# EAGLE design MQTTUSBSwitch (EAGLE 9.6.0)
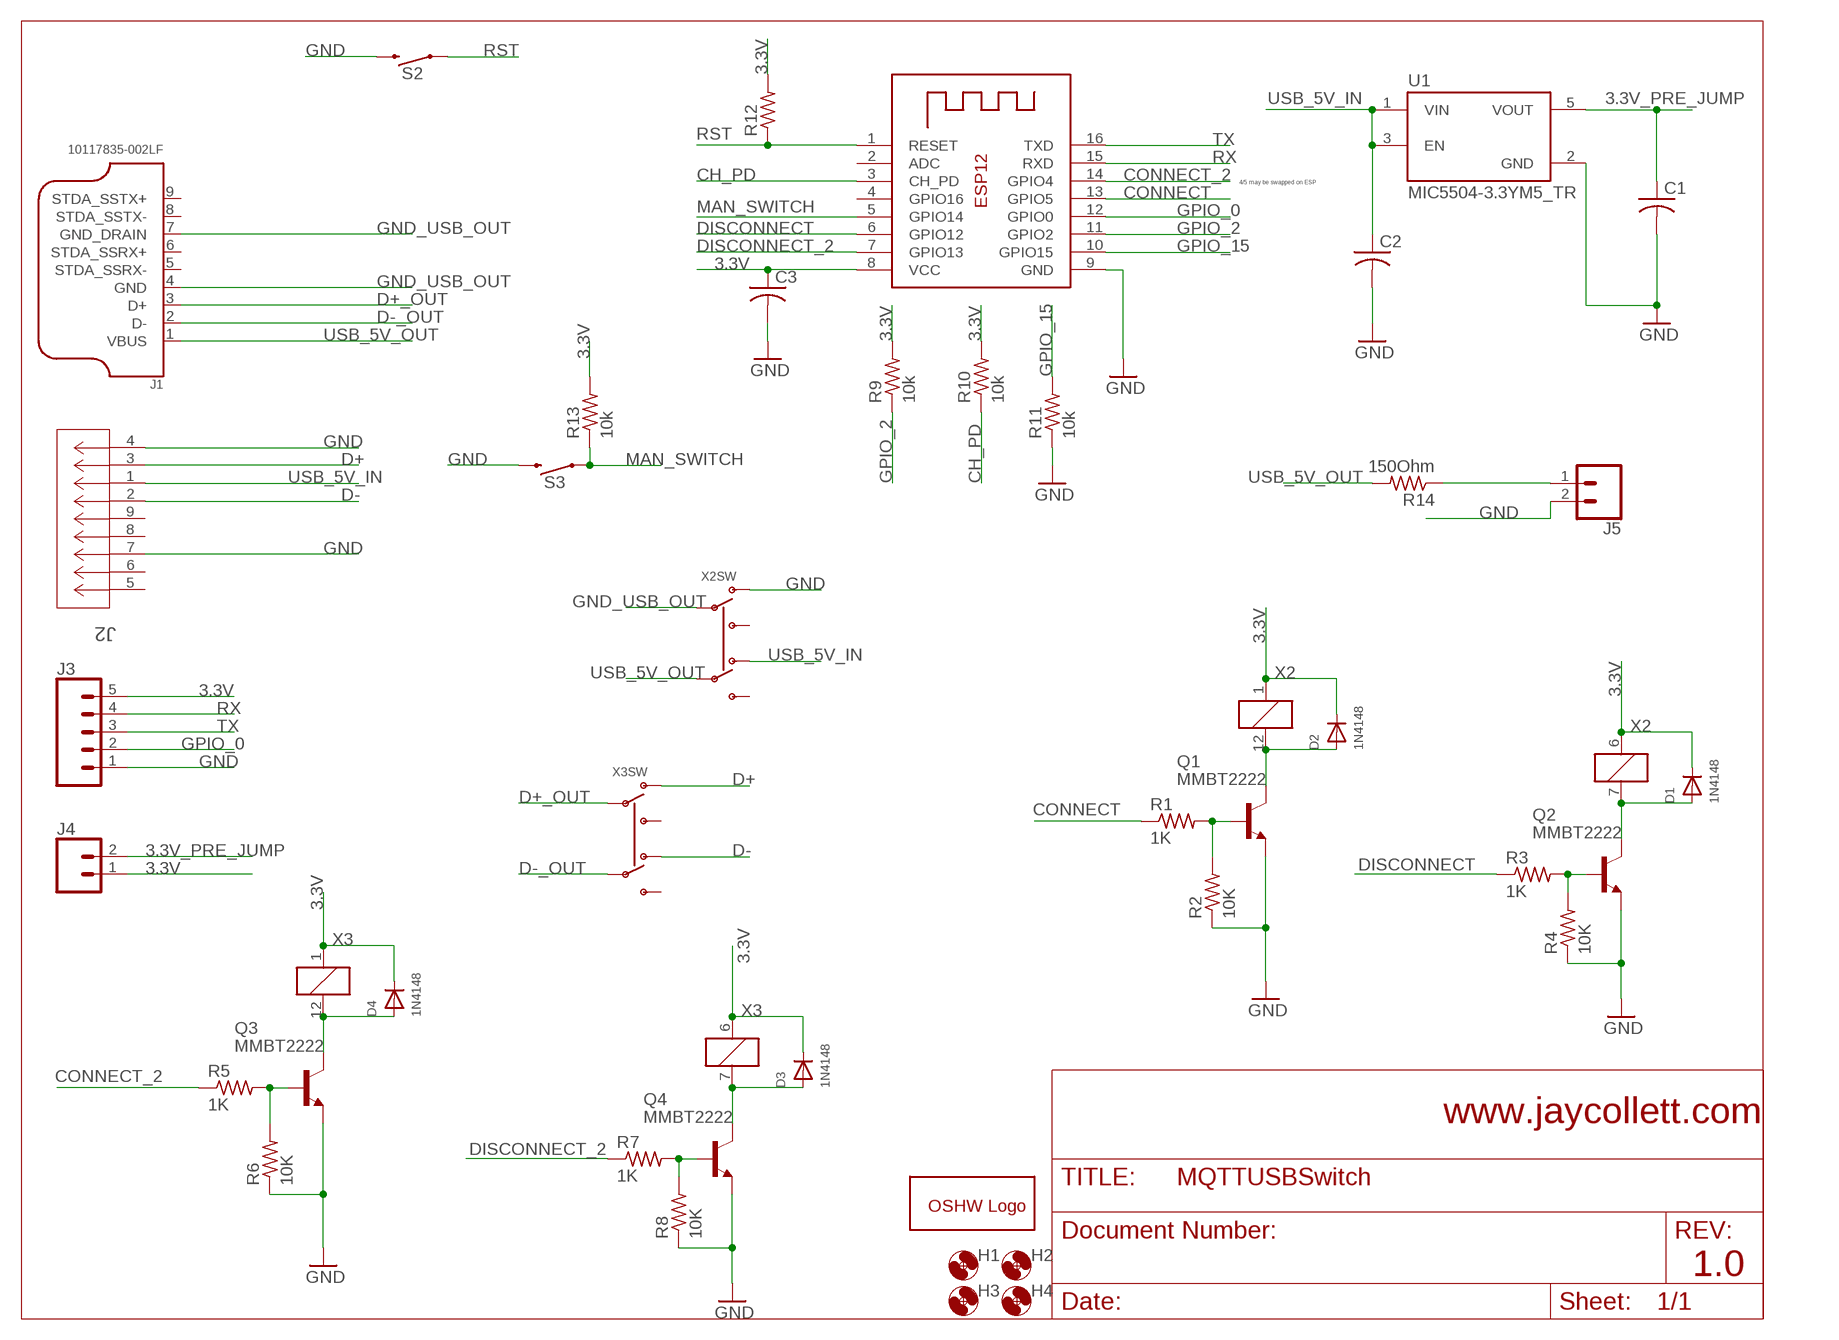
[diagram p0: schematic, sheet 1]

## Parts
C1  C-USC0805  [C0805]
C2  C-USC0805  [C0805]
C3  C-USC0805  [C0805]
D1  1N4148  DIODESOD-323F  [SOD-323F]
D2  1N4148  DIODESOD-323F  [SOD-323F]
D3  1N4148  DIODESOD-323F  [SOD-323F]
D4  1N4148  DIODESOD-323F  [SOD-323F]
GOLD_ORB_SM1  OSHWLOGOLOGO5MM  [OSHW_5MM]
H1  MOUNT-HOLE3.0  [3,0]
H2  MOUNT-HOLE3.0  [3,0]
H3  MOUNT-HOLE3.0  [3,0]
H4  MOUNT-HOLE3.0  [3,0]
J1  10117835-002LF  [FCI_10117835-002LF]
J2  GSB4211311WEU  [CONN9_1311WEU_AMP]
J3  CONN_05  [1X05]
J4  CONN_02  [1X02]
J5  CONN_02  [1X02]
Q1  MMBT2222  [SOT23-BEC]
Q2  MMBT2222  [SOT23-BEC]
Q3  MMBT2222  [SOT23-BEC]
Q4  MMBT2222  [SOT23-BEC]
R1  1K  R-US_M0805  [M0805]
R2  10K  R-US_M0805  [M0805]
R3  1K  R-US_M0805  [M0805]
R4  10K  R-US_M0805  [M0805]
R5  1K  R-US_M0805  [M0805]
R6  10K  R-US_M0805  [M0805]
R7  1K  R-US_M0805  [M0805]
R8  10K  R-US_M0805  [M0805]
R9  10k  R-US_R0805  [R0805]
R10  10k  R-US_R0805  [R0805]
R11  10k  R-US_R0805  [R0805]
R12  R-US_R0805  [R0805]
R13  10k  R-US_R0805  [R0805]
R14  150Ohm  R-US_R0805  [R0805]
S2  MOMENTARY-SWITCH-SPST-PTH-6.0MM-KIT  [TACTILE_SWITCH_PTH_6.0MM_KIT]
S3  MOMENTARY-SWITCH-SPST-PTH-6.0MM-KIT  [TACTILE_SWITCH_PTH_6.0MM_KIT]
U1  MIC5504-3.3YM5_TR  [SOT95P280X145-5N]
X1  ESP-12  [ESP-12]
X2  MICROBUILDER_RELAY_LATCHINGEE2NUH  [MICROBUILDER_RELAY_EE2_LATCH]
X3  MICROBUILDER_RELAY_LATCHINGEE2NUH  [MICROBUILDER_RELAY_EE2_LATCH]

## Nets
3.3V [3.3Volt]: C3.1 D1.C D2.C D3.C D4.C J3.5 J4.1 R9.2 R10.2 R12.2 R13.2 X1.8(VCC) X2.1 X2.6 X3.1 X3.6
3.3V_PRE_JUMP [3.3Volt]: C1.1 J4.2 U1.5(VOUT)
CH_PD: R10.1 X1.3(CH_PD)
CONNECT: R1.1 X1.13(GPIO5)
CONNECT_2: R5.1 X1.14(GPIO4)
D+: J2.3 X3.10(SW:O1)
D+_OUT: J1.3(D+) X3.9(SW:P1)
D-: J2.2 X3.3(SW:O2)
D-_OUT: J1.2(D-) X3.4(SW:P2)
DISCONNECT: R3.1 X1.6(GPIO12)
DISCONNECT_2: R7.1 X1.7(GPIO13)
GND: C1.2 C2.2 C3.2 J2.4 J2.7 J3.1 J5.2 Q1.E Q2.E Q3.E Q4.E R2.1 R4.1 R6.1 R8.1 R11.1 S2.3 S3.3 U1.2(GND) X1.9(GND) X2.10(SW:O1)
GND_USB_OUT [5.0Volt]: J1.4(GND) J1.7(GND_DRAIN) X2.9(SW:P1)
GPIO_0: J3.2 X1.12(GPIO0)
GPIO_2: R9.1 X1.11(GPIO2)
GPIO_15: R11.2 X1.10(GPIO15)
MAN_SWITCH: R13.1 S3.1 X1.5(GPIO14)
N$1: J5.1 R14.1
N$10: D2.A Q1.C X2.12
N$11: D1.A Q2.C X2.7
N$12: Q1.B R1.2 R2.2
N$13: Q2.B R3.2 R4.2
N$14: D4.A Q3.C X3.12
N$15: D3.A Q4.C X3.7
N$16: Q3.B R5.2 R6.2
N$17: Q4.B R7.2 R8.2
RST: R12.1 S2.1 X1.1(RESET)
RX: J3.4 X1.15(RXD)
TX: J3.3 X1.16(TXD)
USB_5V_IN [5.0Volt]: C2.1 J2.1 U1.1(VIN) U1.3(EN) X2.3(SW:O2)
USB_5V_OUT [5.0Volt]: J1.1(VBUS) R14.2 X2.4(SW:P2)
Unconnected: J1.5(STDA_SSRX-) J1.6(STDA_SSRX+) J1.8(STDA_SSTX-) J1.9(STDA_SSTX+) J2.5 J2.6 J2.8 J2.9 X1.2(ADC) X1.4(GPIO16) X2.5(SW:S2) X2.8(SW:S1) X3.5(SW:S2) X3.8(SW:S1)

## Notes on the sheet
- 4/5 may be swapped on ESP
- www.jaycollett.com
- 1.0

## Library data of the parts
C1-C3 = adafruit:C-US: CAPACITOR, American symbol
D1-D4 = adafruit:DIODE: Diode SMADIODE - SMA Surface Mount Package 20V 1A Schottky Diode Digikey: 641-1014-6-ND DO-1N4148 - Through Hole Small Current Diode SOD-123 20V 1 A (.5mV Vf) Schottky Diode - Digikey: MBRX120TPMSCT-ND SOD-323 10V 570mA (.38mV Vf, 3ns) Schottky Diode - Digikey: ZLLS410CT-ND SOD-523 30V 30mA Schottky Diode (RB751S-40TE61) - Digikey: RB751S-40TE61CT-ND SOT23-R/W - SOT23 Package (R = Solder Paste/Reflow Ovens, W = Hand-Soldering) BAT54Film 40V 300mA - Digikey: 497-7162-1-ND
GOLD_ORB_SM1 = oshw:OSHWLOGO: The OSHW logo for PCB layout
H1-H4 = holes:MOUNT-HOLE: MOUNTING HOLE with drill center marker
J1 = 10117835-002LF:10117835-002LF: Conn USB Type A RCP 9 POS 2mm Solder RA Thru-Hole 9 Terminal 1 Port Tray; DESCRIPTION: USB-A (USB TYPE-A) USB 3.2 Gen 1 (USB 3.1 Gen 1, Superspeed (USB 3.0)) Receptacle Connector 9 Position Through Hole, Right Angle; DIGI-KEY_PART_NUMBER: 609-4662-ND; MF: Amphenol ICC (FCI); MP: 10117835-002LF; PACKAGE: None; PURCHASE-URL: https://pricing.snapeda.com/search/part/10117835-002LF/?ref=eda
J2 = USBConnector:GSB4211311WEU; BUILT_BY: EMA_Matt; COPYRIGHT: Copyright (C) 2018 Accelerated Designs. All rights reserved; DATASHEET: https://www.mouser.com/datasheet/2/18/1/gsb4211xxxweu-1365280.pdf; MANUFACTURER_PART_NUMBER: GSB4211311WEU; SOURCELIBRARY: Amphenol_ICC_2020-09-14; VENDOR: Amphenol
J3 = SparkFun-Connectors:CONN_05: Multi connection point. Often used as Generic Header-pin footprint for 0.1 inch spaced/style header connections On any of the 0.1 inch spaced packages, you can populate with these: Break Away Headers - Straight <https://www.sparkfun.com/products/116> (PRT-00116) Break Away Male Headers - Right Angle <https://www.sparkfun.com/products/553> (PRT-00553) Female Headers <https://www.sparkfun.com/products/115> (PRT-00115) Break Away Headers - Machine Pin <https://www.sparkfun.com/products/117> (PRT-00117) Break Away Female Headers - Swiss Machine Pin <https://www.sparkfun.com/products/743> (PRT-00743) For SCREWTERMINALS and SPRING TERMINALS visit here: Screw Terimnals on SparkFun.com <https://www.sparkfun.com/search/results?term=Screw+Terminals> (5mm/3.5mm/2.54mm spacing) This device is also useful as a general connection point to wire up your design to another part of your project. Our various solder wires solder well into these plated through hole pads. Hook-Up Wire - Assortment (Stranded, 22 AWG) <https://www.sparkfun.com/products/11375> (PRT-11375) Hook-Up Wire - Assortment (Solid Core, 22 AWG) <https://www.sparkfun.com/products/11367> (PRT-11367) View the entire wire category on our website here <https://www.sparkfun.com/categories/141> Special notes: Molex polarized connector foot print use with SKU : PRT-08231 with associated crimp pins and housings. 1MM SMD Version SKU: PRT-10208
J4 J5 = SparkFun-Connectors:CONN_02: Multi connection point. Often used as Generic Header-pin footprint for 0.1 inch spaced/style header connections On any of the 0.1 inch spaced packages, you can populate with these: Break Away Headers - Straight <https://www.sparkfun.com/products/116> (PRT-00116) Break Away Male Headers - Right Angle <https://www.sparkfun.com/products/553> (PRT-00553) Female Headers <https://www.sparkfun.com/products/115> (PRT-00115) Break Away Headers - Machine Pin <https://www.sparkfun.com/products/117> (PRT-00117) Break Away Female Headers - Swiss Machine Pin <https://www.sparkfun.com/products/743> (PRT-00743) For SCREWTERMINALS and SPRING TERMINALS visit here: Screw Terimnals on SparkFun.com <https://www.sparkfun.com/search/results?term=Screw+Terminals> (5mm/3.5mm/2.54mm spacing) This device is also useful as a general connection point to wire up your design to another part of your project. Our various solder wires solder well into these plated through hole pads. Hook-Up Wire - Assortment (Stranded, 22 AWG) <https://www.sparkfun.com/products/11375> (PRT-11375) Hook-Up Wire - Assortment (Solid Core, 22 AWG) <https://www.sparkfun.com/products/11367> (PRT-11367) View the entire wire category on our website here <https://www.sparkfun.com/categories/141> Special notes: Molex polarized connector foot print use with: PRT-08233 with associated crimp pins and housings. 2.54_SCREWTERM for use with PRT-10571. 3.5mm Screw Terminal footprints for PRT-08084 5mm Screw Terminal footprints for use with PRT-08432
Q1-Q4 = MMBT2222_:MMBT2222*: NPN Transistor; AVAILABILITY: Unavailable; DESCRIPTION: Bipolar (BJT) Transistor NPN 40V 600mA 300MHz 225mW Surface Mount SOT-23; MF: ON Semiconductor; MP: MMBT2222; PACKAGE: SOT-23-3 Fairchild Semiconductor; PRICE: None
R1-R14 = adafruit:R-US_: RESISTOR, American symbol
S2 S3 = SparkFun-Switches:MOMENTARY-SWITCH-SPST: Momentary Switch (Pushbutton) - SPST Normally-open (NO) SPST momentary switches (buttons, pushbuttons). Variants PTH-12MM - 12mm square, through-hole Momentary Pushbutton Switch - 12mm Square <https://www.sparkfun.com/products/9190> (COM-09190) PTH-6.0MM, PTH-6.0MM-KIT - 6.0mm square, through-hole Mini Pushbutton Switch <https://www.sparkfun.com/products/97> (COM-00097) KIT package intended for soldering kit's - only one side of pads' copper is exposed. PTH-RIGHT-ANGLE-KIT - Right-angle, through-hole Right Angle Tactile Button <https://www.sparkfun.com/products/10791> - Used on SparkFun BigTime Watch Kit <https://www.sparkfun.com/products/11734> SMD-12MM - 12mm square, surface-mount Tactile Button - SMD (12mm) <https://www.sparkfun.com/products/12993> (COM-12993) Used on SparkFun PicoBoard <https://www.sparkfun.com/products/11888> SMD-4.5MM - 4.5mm Square Trackball Switch Used on SparkFun Blackberry Trackballer Breakout <https://www.sparkfun.com/products/13169> SMD-4.6MMX2.8MM - 4.60mm x 2.80mm, surface mount Used on SparkFun SAMD21 Mini Breakout <https://www.sparkfun.com/products/13664> SMD-5.2MM, SMD-5.2-REDUNDANT - 5.2mm square, surface-mount Mini Pushbutton Switch - SMD <https://www.sparkfun.com/products/8720> (COM-08720) Used on Arduino Pro Mini <https://www.sparkfun.com/products/11114> REDUNDANT package connects both switch circuits together SMD-6.0X3.5MM - 6.0 x 3.5mm, surface mount Momentary Reset Switch SMD <https://www.sparkfun.com/products/8229> (COM-08229) SMD-6.2MM-TALL - 6.2mm square, surface mount Tactile Button - SMD (6mm) <https://www.sparkfun.com/products/12992> Used on SparkFun Digital Sandbox <https://www.sparkfun.com/products/12651> SMD-RIGHT-ANGLE - Right-angle, surface mount Used on SparkFun Block for Intel® Edison - Arduino <https://www.sparkfun.com/products/13036>; PROD_ID: SWCH-08441; SF_SKU: COM-00097
U1 = MIC5504-3.3YM5_TR:MIC5504-3.3YM5_TR: Linear Voltage Regulator IC 1 Output 300mA SOT-23-5; AVAILABILITY: Unavailable; DESCRIPTION: Linear Voltage Regulator IC 1 Output 300mA SOT-23-5; MF: Microchip; MP: MIC5504-3.3YM5 TR; PACKAGE: SOT-23 Microchip; PRICE: None
X1 = adafruit:ESP-12
X2 X3 = AdaFruitLatchingRelay:MICROBUILDER_RELAY_LATCHING

## Net classes
0 default: width 0.254 mm, clearance 0.254 mm
1 3.3Volt: width 0.305 mm, clearance 0.254 mm to class 0, clearance 0.254 mm
2 5.0Volt: width 0.508 mm, clearance 0.254 mm to class 0, clearance 0.254 mm to class 1, clearance 0.254 mm

## Board
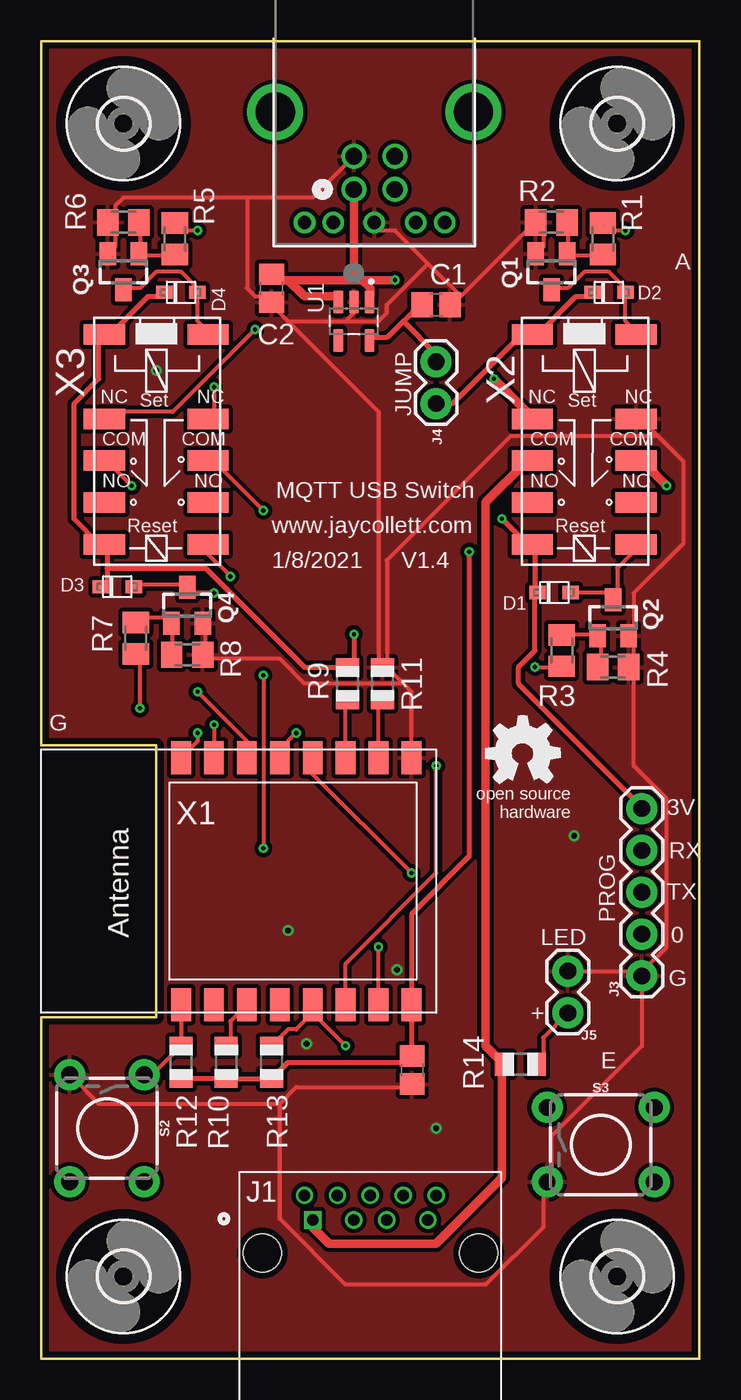
[diagram p1: board, top side]
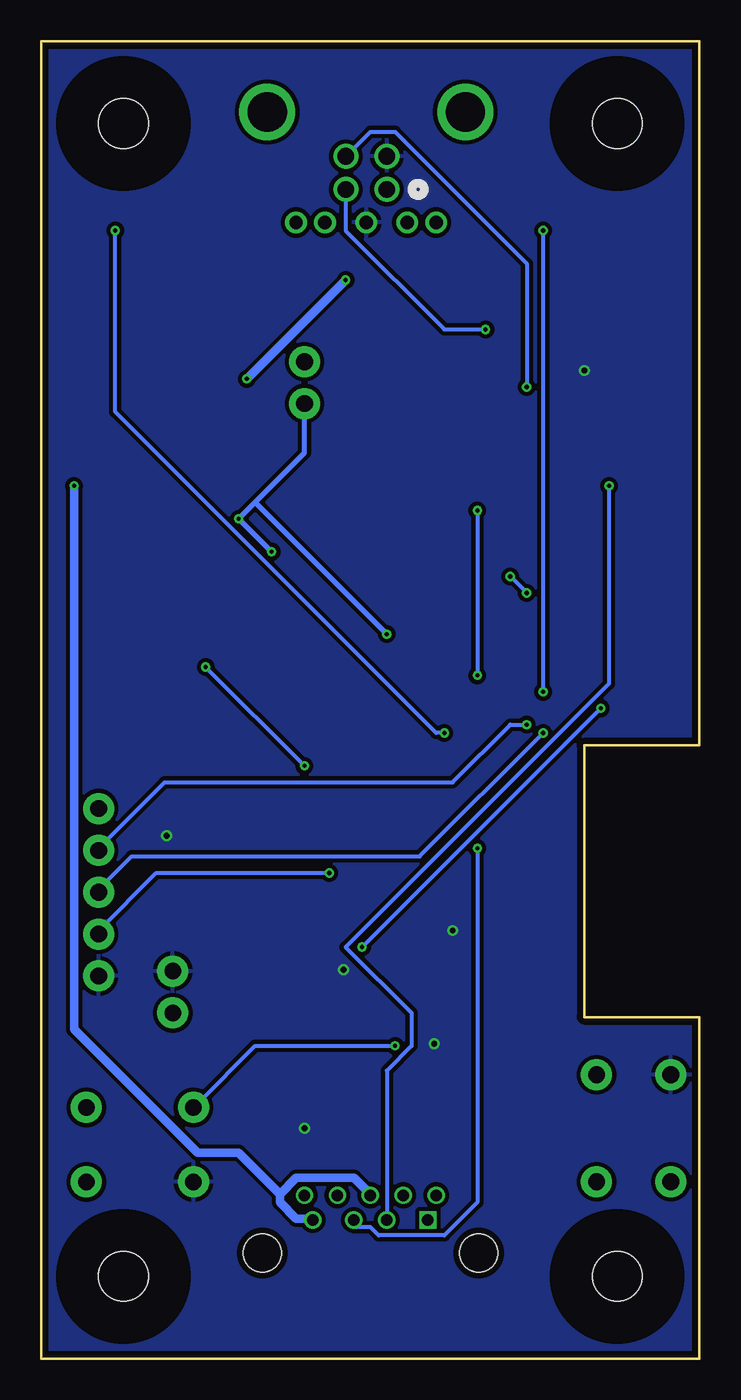
[diagram p2: board, bottom side, seen from below]

Size 40 x 80 mm. Coordinates in mm from the lower left corner, seen from the top.
Outline: 0,0 40,0 40,80 0,80 0,37.25 7,37.25 7,20.75 0,20.75 0,0
Copper layers (1*16): Top 0.035559375mm / dielectric 1.6mm / Bottom 0.035559375mm
Design rules "oshpark-2layer-auto-routing *": minimum track width 10mil, minimum drill 10mil, track to track 10mil, track to pad 8mil, pad to pad 8mil, via to via 8mil, smd to smd 6mil, copper to edge 15mil, drill to drill 6mil, minimum pad ring 6mil, minimum via ring 6mil, stop-mask expansion 2.5mil, vias tented up to drill 20mil, thermal gap 10mil

### Footprints (pad centres in the part's own frame; a part is rotated, then mirrored left to right if it is on the bottom)
C0805 = smd 1.3 x 1.5: 1 -0.85,0; 2 0.85,0
SOD-323F = smd 1 x 0.8: A -1,0; C 1,0
3,0 = hole 3: 0,0
FCI_10117835-002LF = drill 0.7 square: 1 -3.5,5.43 | drill 0.7: 2 -1,5.43; 3 1,5.43; 4 3.5,5.43; 5 4,6.93; 6 2,6.93; 7 0,6.93; 8 -2,6.93; 9 -4,6.93 | hole 2.3: -6.57,3.43; 6.57,3.43
CONN9_1311WEU_AMP = drill 1.016 pad 1.524: 1 0,0; 2 -2.489,0; 3 -2.489,-2.007; 4 0,-2.007 | drill 0.813 pad 1.321: 5 -5.512,2.007; 6 -3.759,2.007; 7 -1.245,2.007; 8 1.245,2.007; 9 2.997,2.007 | drill 2.388 pad 2.896: 10 -7.264,-4.699; 11 4.775,-4.699
1X05 = drill 1.016 pad 1.88: 1 0,0; 2 2.54,0; 3 5.08,0; 4 7.62,0; 5 10.16,0
1X02 = drill 1.016 pad 1.88: 1 0,0; 2 2.54,0
SOT23-BEC = smd 1 x 1.4: B -0.95,-1.1; C 0,1.1; E 0.95,-1.1
M0805 = smd 1.3 x 1.6: 1 -0.95,0; 2 0.95,0
R0805 = smd 1.1 x 1.4: 1 -1,0; 2 1,0
TACTILE_SWITCH_PTH_6.0MM_KIT = drill 1.016 pad 1.88: 1 -3.251,2.261; 2 3.251,2.261; 3 -3.251,-2.261; 4 3.251,-2.261
SOT95P280X145-5N = smd 1.39 x 0.58: 1 -1.165,0.95; 2 -1.165,0; 3 -1.165,-0.95; 4 1.165,-0.95; 5 1.165,0.95
ESP-12 = smd 2 x 1.2: 1 -7.5,4.5; 2 -7.5,2.5; 3 -7.5,0.5; 4 -7.5,-1.5; 5 -7.5,-3.5; 6 -7.5,-5.5; 7 -7.5,-7.5; 8 -7.5,-9.5; 9 7.5,-9.5; 10 7.5,-7.5; 11 7.5,-5.5; 12 7.5,-3.5; 13 7.5,-1.5; 14 7.5,0.5; 15 7.5,2.5; 16 7.5,4.5
MICROBUILDER_RELAY_EE2_LATCH = smd 1.25 x 2.5: 1 -6.2,-3.15; 3 -1.07,-3.15; 4 1.47,-3.15; 5 4.01,-3.15; 6 6.55,-3.15; 7 6.55,3.15; 8 4.01,3.15; 9 1.47,3.15; 10 -1.07,3.15; 12 -6.2,3.15

### Placement (x,y rotation side)
C1  24,64 0 top
C2  14,65 270 top
C3  22.54,17.54 270 top
D1  31.18,46.53 180 top
D2  34.5,64.75 180 top
D3  4.62,46.88 180 top
D4  8.5,64.75 180 top
GOLD_ORB_SM1  29.25,36.75 0 top
H1  35,5 0 top
H2  5,75 0 top
H3  35,75 0 top
H4  5,5 0 top
J1  20,3 0 top
J2  19,71 180 top
J3  36.5,23.25 90 top
J4  24,58 90 top
J5  32,21 90 top
Q1  31,66 180 top
Q2  34.75,45 0 top
Q3  5,66 180 top
Q4  8.88,45.75 0 top
R1  34.12,68 270 top
R2  31,69 0 top
R3  31.62,43 90 top
R4  34.75,42 180 top
R5  8.12,68 270 top
R6  5,69 0 top
R7  5.75,43.75 90 top
R8  8.88,42.75 180 top
R9  18.62,41 90 top
R10  11.25,18 270 top
R11  20.75,41 270 top
R12  8.5,18 270 top
R13  14,18 270 top
R14  29.12,17.88 180 top
S2  4,14 270 top
S3  34,13 0 top
U1  19,63 270 top
X1  13,29 90 top
X2  33,56 270 top
X3  7,56 270 top

### Tracks (layer width: path | path; a pad name or v marks a point on that pad's centre or on a via)
3.3V  (via drill 0.25)
  Top 0.305: D4.C 7.5,64.5 6.5,64.5 4,62 X3.1 3.5,62 3.5,59.5 2,58 2,51 3.5,49.5 X3.6 4,49 4,48 | 4,48 4,47 D3.C | 4,48 10,48 16,42 R9.2 19,42 v19,44 | R12.2 R10.2 R13.2 15,18 22.5,18 C3.1 22.5,18.5 X1.8 22.5,27 26,30.5 v26,49 | D2.C 33.5,64.5 32.5,64.5 30,62 X2.1 29.5,62.5 25,58 J4.1 | 30,46.5 30,49 X2.6 29.5,49.5 v28,51 | 30,46.5 30,43 29,42 29,41 36.5,33.5 J3.5 | 30,46.5 D1.C
  Bottom 0.305: J4.1 24,55 27,52 | 27,52 v28,51 v26,49 | 27,52 v19,44
3.3V_PRE_JUMP
  Top 0.305: 22,63 23,64 C1.1 | 22,63 21,62 20,62 U1.5 | 22,63 24,61 J4.2
CH_PD
  Top 0.254: X1.3 11.5,20.5 11.5,19 R10.1
CONNECT  (via drill 0.25)
  Top 0.254: v35.5,68.5 34.5,68.5 R1.1 | v15.5,38 14.5,37 X1.13
  Bottom 0.254: v35.5,68.5 35.5,57.5 16,38 v15.5,38
CONNECT_2  (via drill 0.25)
  Top 0.254: v9.5,68.5 8.5,68.5 R5.1 | v9.5,40.5 12.5,37.5 X1.14
  Bottom 0.254: v9.5,40.5 v9.5,68.5
D+  (via drill 0.25)
  Top 0.254: v10.5,59 10.5,57.5 X3.10
  Bottom 0.254: v10.5,59 10.5,66.5 18.5,74.5 20,74.5 21,73.5 J2.3
D+_OUT  (via drill 0.25)
  Top 0.254: v13.5,41.5 v13.5,31 | v13.5,51.5 10.5,54.5 X3.9
  Bottom 0.254: v13.5,31 13.5,9.5 15.5,7.5 19.5,7.5 20,8 21,8 J1.3 | v13.5,51.5 v13.5,41.5
D-  (via drill 0.25)
  Top 0.254: v13,62.5 8,57.5 4,57.5 X3.3
  Bottom 0.254: v13,62.5 15.5,62.5 21.5,68.5 J2.2
D-_OUT  (via drill 0.25)
  Top 0.254: v5.5,53 4,54.5 X3.4
  Bottom 0.254: J1.2 19,17.5 17.5,19 17.5,21 21.5,25 5.5,41 v5.5,53
DISCONNECT  (via drill 0.25)
  Top 0.254: v30,42 31.5,42 R3.1 | v24,36 24,29.5 18.5,24 X1.6
  Bottom 0.254: v24,36 v30,42
DISCONNECT_2  (via drill 0.25)
  Top 0.254: v6,39.5 6,42.5 R7.1 | X1.7 v20.5,25
  Bottom 0.254: v20.5,25 v6,39.5
GND  (via drill 0.35)
  Top 0.254: Q4.E 10,44.5 10,43 R8.1 10,42.5 14.5,42.5 16,41 22,41 | 22,41 22.5,40.5 X1.9 | 22,41 21,42 | Q1.E 30.5,67.5 30.5,69 R2.1 30,69 25.5,64.5 | 25.5,64.5 25,64 C1.2 | 25.5,64.5 23.5,66.5 | 23.5,66.5 21.5,68.5 20.5,68.5 J2.7 | U1.2 19,63.5 18.5,63 | 15,63 18.5,63 | 15,63 14,64 C2.2 14,64.5 13,64.5 12.5,65 12.5,70.5 | 4.5,69 4.5,67.5 Q3.E | 4.5,69 4.5,70 5,70.5 12.5,70.5 | 12.5,70.5 16.5,70.5 J2.4 | 4.5,69 R6.1 | 23.5,66.5 21,64 21,63.5 20.5,63 18.5,63 | 15,63 20.5,57.5 20.5,42 R11.1 21,42 | 14.5,15.5 15.5,16.5 22.5,16.5 C3.2 | 14.5,15.5 3.5,15.5 2,17 S2.3 | 36,42 36,43.5 Q2.E 36,44 36,46.5 39,49.5 39,54.5 37.5,56 | 37.5,56 36.5,57 X2.10 | 36.5,23.5 32,23.5 J5.2 | 36,42 36,36 38,34 38,25 36.5,23.5 | 36,42 R4.1 | 36.5,23.5 J3.1 36.5,19 31,13.5 31,11 S3.3 30.5,10.5 30.5,8 27,4.5 18.5,4.5 14.5,8.5 14.5,15.5 | 21,42 21,48.5 28.5,56 37.5,56
  other vias: 7,60 15,26 24,14 16.12,19.12 21.62,23.62 32.38,31.75
  pour Top (isolate 0.015): 0,80 40,80 40,0 0,0
  pour Bottom (isolate 0.015): 0,80 40,80 40,0 0,0
GND_USB_OUT  (via drill 0.25)
  Top 0.508: v38,53 36.5,54.5 X2.9
  Bottom 0.508: 25.5,10 24.5,11 21,11 20,10 J1.7 | 25.5,10 25.5,9.5 24.5,8.5 23.5,8.5 J1.4 | v38,53 38,20 30.5,12.5 28,12.5 25.5,10
GPIO_0  (via drill 0.25)
  Top 0.254: X1.12 16.5,35.5 v22.5,29.5
  Bottom 0.254: v22.5,29.5 33,29.5 36.5,26 J3.2
GPIO_2
  Top 0.254: X1.11 18.5,40 R9.1
GPIO_15
  Top 0.254: X1.10 20.5,40 R11.2
MAN_SWITCH  (via drill 0.25)
  Top 0.254: R13.1 15,20 15.5,20 16.5,21 | v18.5,19 16.5,21 | 16.5,21 X1.5
  Bottom 0.254: v18.5,19 27,19 30.5,15.5 S3.1
N$1
  Top 0.254: J5.1 30.5,19.5 30.5,18 R14.1
N$10
  Top 0.254: X2.12 36,62.5 35.5,63 D2.A 35.5,65 34.5,66 33,66 32,65 31,65 Q1.C
N$11
  Top 0.254: D1.A 32.5,46.5 34.5,46.5 Q2.C 35,46.5 35,48 36,49 X2.7
N$12
  Top 0.254: R2.2 32,69 32,67.5 Q1.B 32,67 34,67 R1.2
N$13
  Top 0.254: R3.2 32,44 33.5,44 Q2.B 34,43.5 34,42 R4.2
N$14
  Top 0.254: X3.12 10,62.5 9.5,63 D4.A 9.5,65 8.5,66 7,66 6,65 5,65 Q3.C
N$15  (via drill 0.25)
  Top 0.254: D3.A 6,47 8.5,47 Q4.C 9,46.5 v10.5,46.5 | v11.5,47.5 10,49 X3.7
  Bottom 0.254: v11.5,47.5 v10.5,46.5
N$16
  Top 0.254: R6.2 6,69 6,67.5 Q3.B 6,67 8,67 R5.2
N$17
  Top 0.254: R8.2 8,43 8,44.5 Q4.B 7.5,45 6,45 R7.2
RST
  Top 0.254: X1.1 R12.1 6.5,17 S2.1
RX  (via drill 0.25)
  Top 0.254: v10.5,38.5 X1.15
  Bottom 0.254: v10.5,38.5 11.5,38.5 15,35 32.5,35 36.5,31 J3.4
TX  (via drill 0.25)
  Top 0.254: X1.16 9.5,37.5 v9.5,38
  Bottom 0.254: v9.5,38 17,30.5 34.5,30.5 36.5,28.5 J3.3
USB_5V_IN  (via drill 0.25)
  Top 0.508: 15,65.5 16,64.5 18,64.5 U1.3 | 15,65.5 14,65.5 C2.1 | 19.5,65.5 20,65 20,64.5 U1.1 | 15,65.5 19,65.5 | 19,65.5 19.5,65.5 | v27.5,59.5 29.5,57.5 X2.3 | 19.5,65.5 v21.5,65.5 | 19,65.5 J2.1
  Bottom 0.508: v21.5,65.5 v27.5,59.5
USB_5V_OUT
  Top 0.508: J1.1 16.5,8 17.5,7 24,7 28,11 28,17.5 R14.2 27,19 27,52 29.5,54.5 X2.4

### Text on the board
tPlace: A | JUMP | MQTT USB Switch | www.jaycollett.com | 1/8/2021 | V1.4 | G | 3V | RX | TX | LED | PROG | 0 | G | + | E